# Altium schematic sheet AND_5_entradas.SchDoc
size A4; PageSetup: Record=PageOptions|CenterHorizontal=True|CenterVertical=True|PrintScale=0.97|XCorrection=1.00|YCorrection=1.00|PrintKind=2|BorderSize=5000000|LeftOffset=0|BottomOffset=0|Orientation=2|PaperLength=1000|PaperWidth=1000|Scale=100|PaperSource=7|PrintQuality=-4|MediaType=1|DitherType=10|PaperKind=A4|PrintScaleMode=1
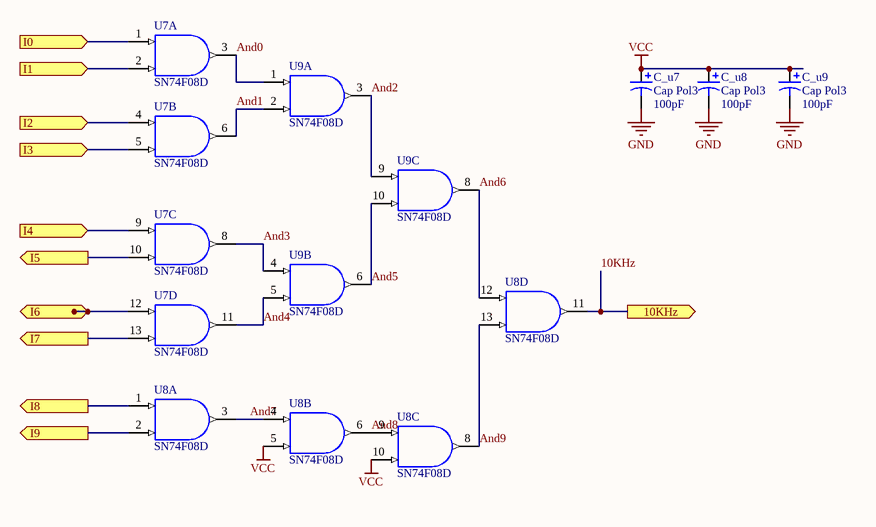
[diagram p0: AND_5_entradas.SchDoc]

## Parts
C_u7  Cap Pol3  value 100pF  [C0805]
C_u8  Cap Pol3  value 100pF  [C0805]
C_u9  Cap Pol3  value 100pF  [C0805]
U7  SN74F08D  [D014_N]  (parts A,B,C,D of 4)
U8  SN74F08D  [D014_N]  (parts A,B,C,D of 4)
U9  SN74F08D  [D014_N]  (parts A,B,C of 4)

## Ports
10KHz (out), I0 (in), I1 (in), I2 (in), I3 (in), I4 (in), I5 (out), I6 (out), I7 (out), I8 (out), I9 (out)

## Nets
GND: C_u7.2 C_u8.2 C_u9.2 U7.7(GND) U8.7(GND) U9.7(GND)
VCC: C_u7.1 C_u8.1 C_u9.1 U7.14(VCC) U8.5(B) U8.10(B) U8.14(VCC) U9.14(VCC)
10KHz: U8.11(Y) ; port 10KHz
And0: U7.3(Y) U9.1(A)
And1: U7.6(Y) U9.2(B)
And2: U9.3(Y) U9.9(A)
And3: U7.8(Y) U9.4(A)
And4: U7.11(Y) U9.5(B)
And5: U9.6(Y) U9.10(B)
And6: U8.12(A) U9.8(Y)
And7: U8.3(Y) U8.4(A)
And8: U8.6(Y) U8.9(A)
And9: U8.8(Y) U8.13(B)
I0: U7.1(A) ; port I0
I1: U7.2(B) ; port I1
I2: U7.4(A) ; port I2
I3: U7.5(B) ; port I3
I4: U7.9(A) ; port I4
I5: U7.10(B) ; port I5
I6: U7.12(A) ; port I6
I7: U7.13(B) ; port I7
I8: U8.1(A) ; port I8
I9: U8.2(B) ; port I9

## Library data of the parts
C_u7-C_u9 = Cap Pol3: Polarized Capacitor (Surface Mount); Published: 8-Jun-2000; LatestRevisionDate: 17-Jul-2002; LatestRevisionNote: Re-released for DXP Platform.; PackageReference: C0805; Publisher: Altium Limited
U7-U9 = SN74F08D: Quadruple 2-Input Positive-AND Gate; Published: 8-Jun-2000; LatestRevisionDate: 13-Apr-2006; LatestRevisionNote: IPC-7351 Footprint Added.; DatasheetVersion: Oct-1993; PackageVersion: Jan-1998; PackageReference: D014; Publisher: Altium Limited; PackageDescription: 14-Pin Small Outline Integrated Circuit 1.27 mm Pitch; Code_IPC: SOIC127P600-14; ComponentLink1Description: Manufacturer Link; ComponentLink1URL: http://www.ti.com/; ComponentLink2Description: Datasheet; ComponentLink2URL: http://www-s.ti.com/sc/ds/SN74F08.pdf